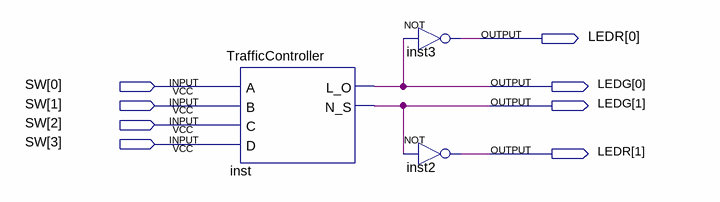
[diagram p0: schematic sheet]
// Quartus schematic questao4.bdf as structural Verilog: 3 symbols, 8 pins
module questao4 (
  input  [3:0] SW,
  output [1:0] LEDR,
  output [1:0] LEDG
);

  TrafficController inst (.A(SW[0]), .B(SW[1]), .C(SW[2]), .D(SW[3]), .L_O(LEDG[0]), .N_S(LEDG[1]));
  not inst3 (LEDR[0], LEDG[0]);
  not inst2 (LEDR[1], LEDG[1]);
endmodule
